# Altium project Buoi1_Project.PrjPcb
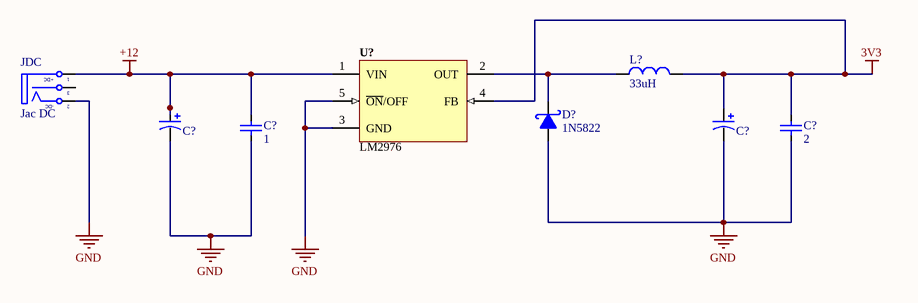
[diagram p0: Sheet1.SchDoc]
1 sheet, 8 parts. Net scope: global (net labels, ports and power ports of the same name join across sheets).
Board file: main.PcbDoc

## Sheet Sheet1.SchDoc
size A; SheetNumber: 1; SheetTotal: 1

### Parts
(Parts that share a designator on the sheet are numbered #1, #2 ... from top to bottom, then left to right.)
C?#1  1  [CAP_0402]
C?#2  680uF-18V  [CAP_7343]  (value not drawn)
C?#3  330uF - 10V  [CAP_7343]  (value not drawn)
C?#4  2  [CAP_0402]
D?  1N5822  [DIOAD2120W130L950D530P]
JDC  Jac DC  [DC-IN]
L?  33uH  [L-SMD-M-12x10]
U?  LM2976  [TO263]

### Nets
3V3: C?#3.1 C?#4.2 L?.2 U?.4(FB)
+12: C?#1.1 C?#2.1 JDC.1(T) U?.1(VIN)
GND: C?#1.2 C?#2.2 C?#3.2 C?#4.1 D?.1(A) JDC.2(TN) U?.3(GND) U?.5(~{ON}/OFF)
NetD?_2: D?.2(K) L?.1 U?.2(OUT)

Not connected (* = marked no-connect by the designer): JDC 3(S)

### Notes on the sheet
- (in symbol DCIN) +DC; -DC

### Library data of the parts
C?#1 C?#4 = CapSMD: Capacitor; Value: 33p; Published: 8-Jun-2000; LatestRevisionDate: 17-Jul-2002; LatestRevisionNote: Re-released for DXP Platform.; PackageReference: RAD-0.3; Publisher: Altium Limited
C?#2 C?#3 = CAP_TAN_SMD: Polazied Tantalum Capacitor
D? = 1N5822: Schottky Rectifiers; Value: Diode c?m 1N5408
JDC = DCIN: Jac DC input; Value: Jac DC
L? = Inductor: Value: 150 mH
U? = LM2596: Max Input Voltage: 12 V; Max Output Current: 3 (6.0 peak) A; Max Output Voltage: mV; Category: IC-Power; Min Input Voltage: mV; Min Output Voltage: mV; Mounting Technology: Surface Mount; Status: Unreleased; Supply Voltage: mV; Temperature Range: -40 to +125 degC